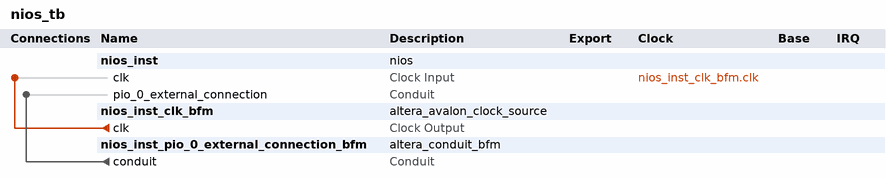
[diagram p0: system contents]
# Platform Designer (Qsys) system nios_tb, Cyclone IV E EP4CE6E22C8
# Parameters at their usual value, and those the tool derives, are not listed.
package require -exact qsys 12.1
create_system nios_tb
set_project_property DEVICE_FAMILY {Cyclone IV E}
set_project_property DEVICE EP4CE6E22C8

add_instance nios_inst nios 1.0

add_instance nios_inst_clk_bfm altera_avalon_clock_source 12.1

add_instance nios_inst_pio_0_external_connection_bfm altera_conduit_bfm 12.1
set_instance_parameter_value nios_inst_pio_0_external_connection_bfm CLOCKED_SIGNAL false
set_instance_parameter_value nios_inst_pio_0_external_connection_bfm ENABLE_RESET false
set_instance_parameter_value nios_inst_pio_0_external_connection_bfm SIGNAL_WIDTHS 8
set_instance_parameter_value nios_inst_pio_0_external_connection_bfm SIGNAL_DIRECTIONS input

# connections
add_connection nios_inst_clk_bfm.clk nios_inst.clk clock
add_connection nios_inst_pio_0_external_connection_bfm.conduit nios_inst.pio_0_external_connection conduit

save_system nios_tb.qsys
